# EAGLE design picostepsynth (EAGLE 9.6.2)
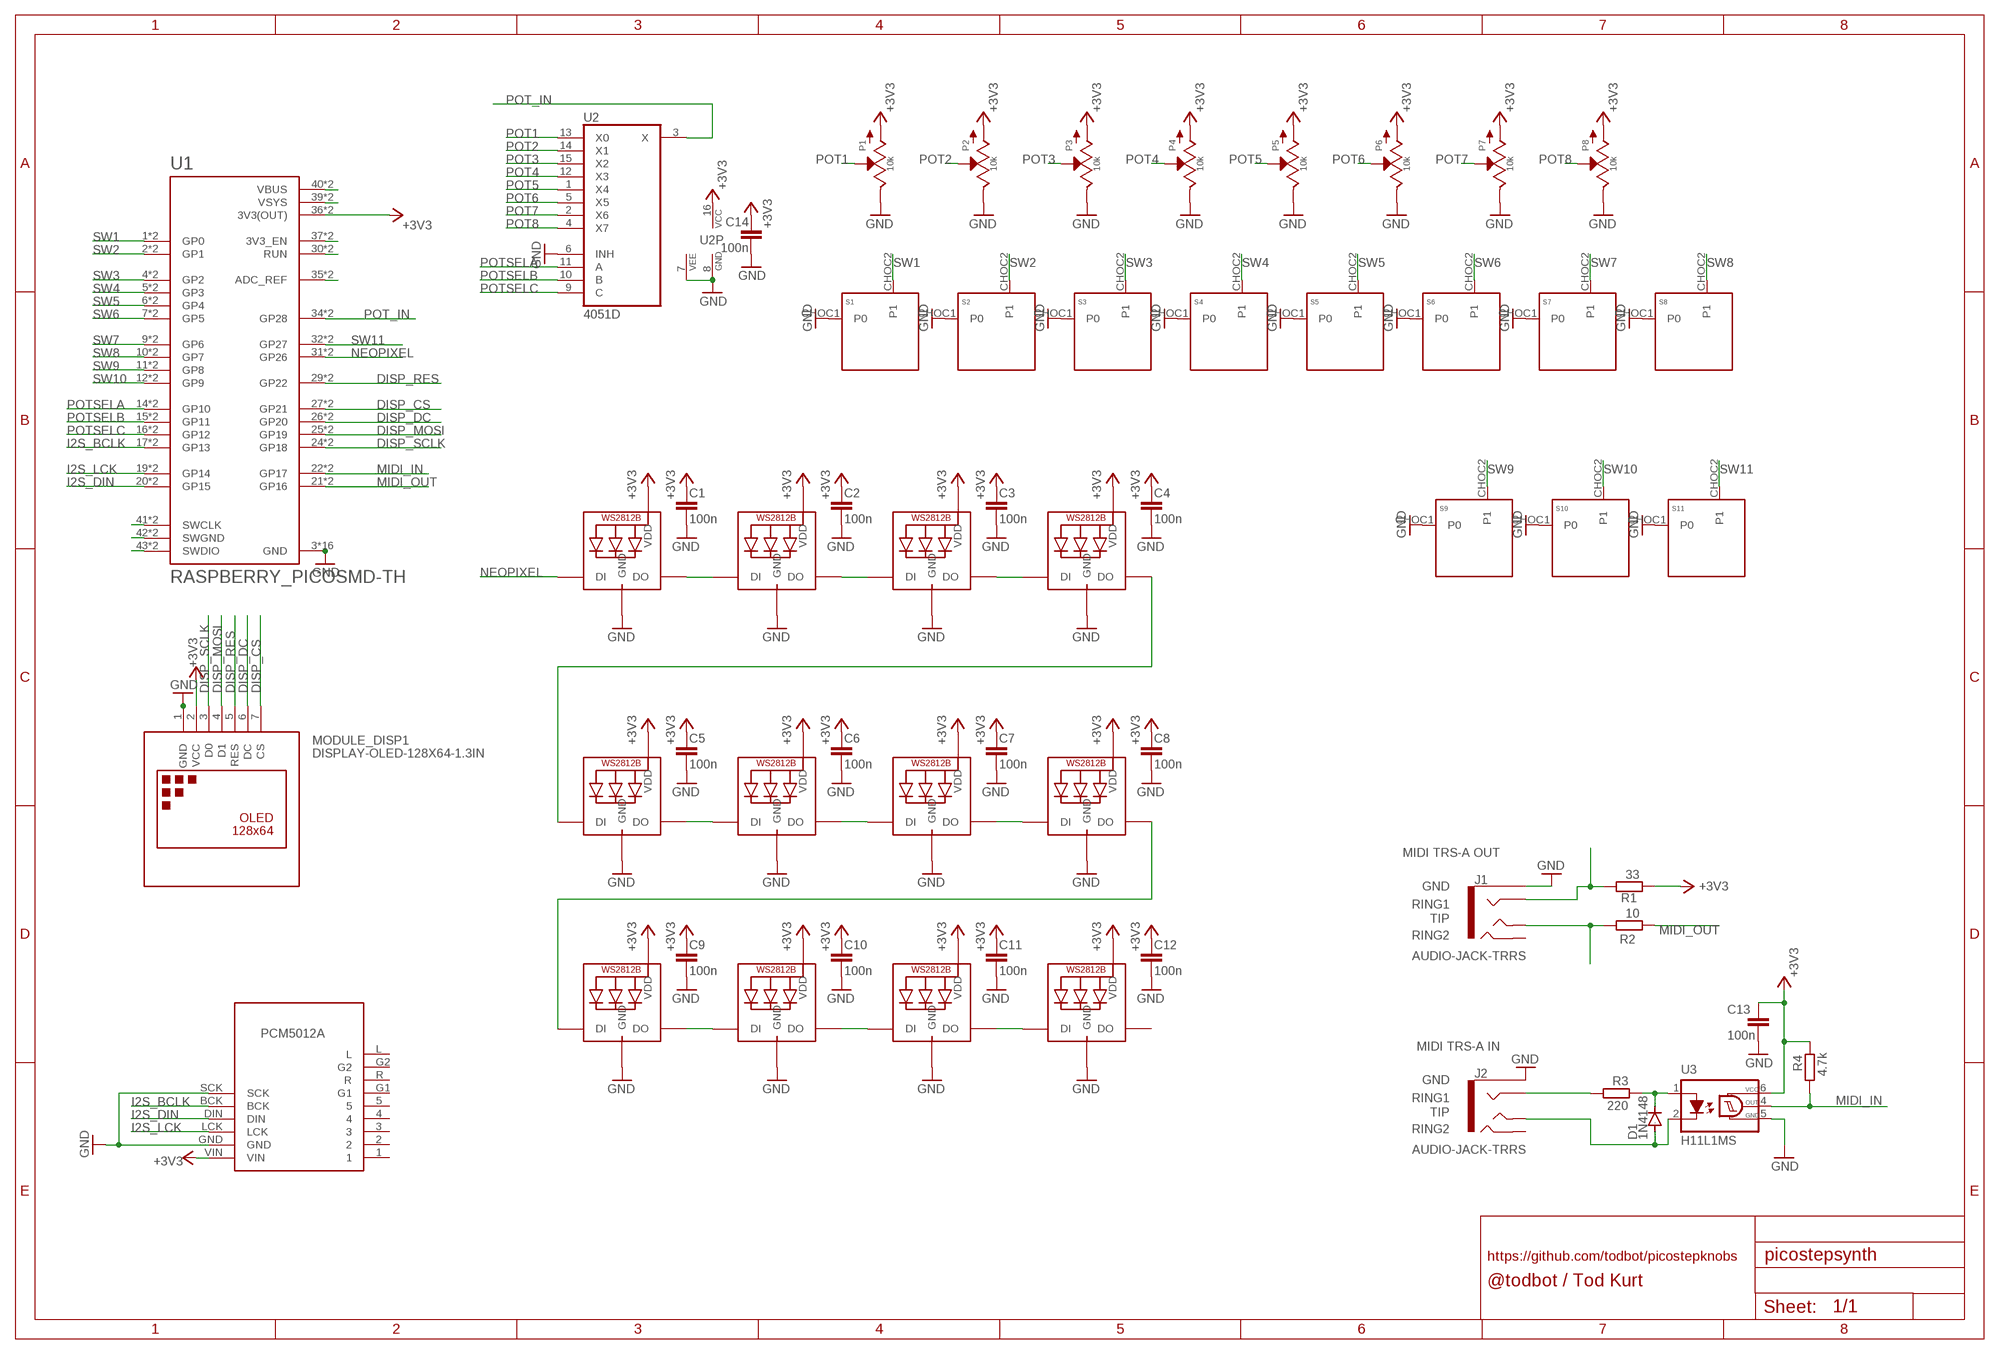
[diagram p0: schematic, sheet 1]

## Parts
C1  100n  C-EUC0805  [C0805]
C2  100n  C-EUC0805  [C0805]
C3  100n  C-EUC0805  [C0805]
C4  100n  C-EUC0805  [C0805]
C5  100n  C-EUC0805  [C0805]
C6  100n  C-EUC0805  [C0805]
C7  100n  C-EUC0805  [C0805]
C8  100n  C-EUC0805  [C0805]
C9  100n  C-EUC0805  [C0805]
C10  100n  C-EUC0805  [C0805]
C11  100n  C-EUC0805  [C0805]
C12  100n  C-EUC0805  [C0805]
C13  100n  C-EUC0805  [C0805]
C14  100n  C-EUC0805  [C0805]
D1  1N4148  DIODE-SOD123  [SOD123]
J1  AUDIO-JACK-TRRS  [PJ-320D_SPARKFUN]
J2  AUDIO-JACK-TRRS  [PJ-320D_SPARKFUN]
LED1  WS2812B5050  [WS2812B]
LED2  WS2812B5050  [WS2812B]
LED3  WS2812B5050  [WS2812B]
LED4  WS2812B5050  [WS2812B]
LED5  WS2812B5050  [WS2812B]
LED6  WS2812B5050  [WS2812B]
LED7  WS2812B5050  [WS2812B]
LED8  WS2812B5050  [WS2812B]
LED9  WS2812B5050  [WS2812B]
LED10  WS2812B5050  [WS2812B]
LED11  WS2812B5050  [WS2812B]
LED12  WS2812B5050  [WS2812B]
MODULE_DISP1  DISPLAY-OLED-128X64-1.3IN  [DISPLAY-OLED-128X64-1.3IN]
MODULE_PCM5102A  I2S_PCM_51XX_SOUNDCARD  [I2S_PCM_5100_SOUNDCARD]
P1  10k  POTZEPHPOT_BIGKNOB  [OG-POTS_ALPS_POT_VERTICAL_WITHBIGKNOB]
P2  10k  POTZEPHPOT_BIGKNOB  [OG-POTS_ALPS_POT_VERTICAL_WITHBIGKNOB]
P3  10k  POTZEPHPOT_BIGKNOB  [OG-POTS_ALPS_POT_VERTICAL_WITHBIGKNOB]
P4  10k  POTZEPHPOT_BIGKNOB  [OG-POTS_ALPS_POT_VERTICAL_WITHBIGKNOB]
P5  10k  POTZEPHPOT_BIGKNOB  [OG-POTS_ALPS_POT_VERTICAL_WITHBIGKNOB]
P6  10k  POTZEPHPOT_BIGKNOB  [OG-POTS_ALPS_POT_VERTICAL_WITHBIGKNOB]
P7  10k  POTZEPHPOT_BIGKNOB  [OG-POTS_ALPS_POT_VERTICAL_WITHBIGKNOB]
P8  10k  POTZEPHPOT_BIGKNOB  [OG-POTS_ALPS_POT_VERTICAL_WITHBIGKNOB]
R1  33  R-EU_R0805  [R0805]
R2  10  R-EU_R0805  [R0805]
R3  220  R-EU_R0805  [R0805]
R4  4.7k  R-EU_R0805  [R0805]
S1  KEYSWITCH-PLAIN-CHOC-1U  [CHOC-1U]
S2  KEYSWITCH-PLAIN-CHOC-1U  [CHOC-1U]
S3  KEYSWITCH-PLAIN-CHOC-1U  [CHOC-1U]
S4  KEYSWITCH-PLAIN-CHOC-1U  [CHOC-1U]
S5  KEYSWITCH-PLAIN-CHOC-1U  [CHOC-1U]
S6  KEYSWITCH-PLAIN-CHOC-1U  [CHOC-1U]
S7  KEYSWITCH-PLAIN-CHOC-1U  [CHOC-1U]
S8  KEYSWITCH-PLAIN-CHOC-1U  [CHOC-1U]
S9  KEYSWITCH-PLAIN-CHOC-1U  [CHOC-1U]
S10  KEYSWITCH-PLAIN-CHOC-1U  [CHOC-1U]
S11  KEYSWITCH-PLAIN-CHOC-1U  [CHOC-1U]
U1  RASPBERRY_PICOSMD-TH  [PICO-PKG]
U2  4051D  [SO16]
U3  H11L1MS  [DIL6-SMD]

## Nets
+3V3: C1.1 C2.1 C3.1 C4.1 C5.1 C6.1 C7.1 C8.1 C9.1 C10.1 C11.1 C12.1 C13.1 C14.1 LED1.1-VDD(VDD) LED2.1-VDD(VDD) LED3.1-VDD(VDD) LED4.1-VDD(VDD) LED5.1-VDD(VDD) LED6.1-VDD(VDD) LED7.1-VDD(VDD) LED8.1-VDD(VDD) LED9.1-VDD(VDD) LED10.1-VDD(VDD) LED11.1-VDD(VDD) LED12.1-VDD(VDD) MODULE_DISP1.2(VCC) MODULE_PCM5102A.VIN P1.P$3(A) P2.P$3(A) P3.P$3(A) P4.P$3(A) P5.P$3(A) P6.P$3(A) P7.P$3(A) P8.P$3(A) R1.2 R4.1 U1.36(3V3(OUT)) U1.P$36(3V3(OUT)) U2.16(VCC) U3.6(VCC)
DISP_CS: MODULE_DISP1.7(CS) U1.27(GP21) U1.P$27(GP21)
DISP_DC: MODULE_DISP1.6(DC) U1.26(GP20) U1.P$26(GP20)
DISP_MOSI: MODULE_DISP1.4(D1) U1.25(GP19) U1.P$25(GP19)
DISP_RES: MODULE_DISP1.5(RES) U1.29(GP22) U1.P$29(GP22)
DISP_SCLK: MODULE_DISP1.3(D0) U1.24(GP18) U1.P$24(GP18)
GND: C1.2 C2.2 C3.2 C4.2 C5.2 C6.2 C7.2 C8.2 C9.2 C10.2 C11.2 C12.2 C13.2 C14.2 J1.EARTH J2.EARTH LED1.3-GND(GND) LED2.3-GND(GND) LED3.3-GND(GND) LED4.3-GND(GND) LED5.3-GND(GND) LED6.3-GND(GND) LED7.3-GND(GND) LED8.3-GND(GND) LED9.3-GND(GND) LED10.3-GND(GND) LED11.3-GND(GND) LED12.3-GND(GND) MODULE_DISP1.1(GND) MODULE_PCM5102A.GND MODULE_PCM5102A.SCK P1.P$1(E) P2.P$1(E) P3.P$1(E) P4.P$1(E) P5.P$1(E) P6.P$1(E) P7.P$1(E) P8.P$1(E) S1.CHOC1(P0) S2.CHOC1(P0) S3.CHOC1(P0) S4.CHOC1(P0) S5.CHOC1(P0) S6.CHOC1(P0) S7.CHOC1(P0) S8.CHOC1(P0) S9.CHOC1(P0) S10.CHOC1(P0) S11.CHOC1(P0) U1.3(GND) U1.8(GND) U1.13(GND) U1.18(GND) U1.23(GND) U1.28(GND) U1.33(GND) U1.38(GND) U1.P$3(GND) U1.P$8(GND) U1.P$13(GND) U1.P$18(GND) U1.P$23(GND) U1.P$28(GND) U1.P$33(GND) U1.P$38(GND) U2.6(INH) U2.7(VEE) U2.8(GND) U3.5(GND)
I2S_BCLK: MODULE_PCM5102A.BCK U1.17(GP13) U1.P$17(GP13)
I2S_DIN: MODULE_PCM5102A.DIN U1.20(GP15) U1.P$20(GP15)
I2S_LCK: MODULE_PCM5102A.LCK U1.19(GP14) U1.P$19(GP14)
MIDI_IN: R4.2 U1.22(GP17) U1.P$22(GP17) U3.4(OUT)
MIDI_OUT: R2.2 U1.21(GP16) U1.P$21(GP16)
N$1: LED1.2-DOUT(DO) LED2.4-DIN(DI)
N$2: LED2.2-DOUT(DO) LED3.4-DIN(DI)
N$3: U1.37(3V3_EN) U1.P$37(3V3_EN)
N$4: LED3.2-DOUT(DO) LED4.4-DIN(DI)
N$5: U1.30(RUN) U1.P$30(RUN)
N$6: U1.35(ADC_REF) U1.P$35(ADC_REF)
N$7: U1.40(VBUS) U1.P$40(VBUS)
N$8: U1.39(VSYS) U1.P$39(VSYS)
N$9: J1.TIP R2.1
N$10: LED4.2-DOUT(DO) LED5.4-DIN(DI)
N$11: LED5.2-DOUT(DO) LED6.4-DIN(DI)
N$12: LED6.2-DOUT(DO) LED7.4-DIN(DI)
N$13: LED7.2-DOUT(DO) LED8.4-DIN(DI)
N$14: LED9.2-DOUT(DO) LED10.4-DIN(DI)
N$15: LED10.2-DOUT(DO) LED11.4-DIN(DI)
N$16: LED11.2-DOUT(DO) LED12.4-DIN(DI)
N$17: LED8.2-DOUT(DO) LED9.4-DIN(DI)
N$18: U1.41(SWCLK) U1.P$41(SWCLK)
N$19: U1.42(SWGND) U1.P$42(SWGND)
N$20: U1.43(SWDIO) U1.P$43(SWDIO)
N$38: J1.RING1 R1.1
N$47: D1.C R3.1 U3.1(A)
N$48: D1.A J2.TIP U3.2(C)
N$49: J2.RING1 R3.2
NEOPIXEL: LED1.4-DIN(DI) U1.31(GP26) U1.P$31(GP26)
POT1: P1.P$2(S) U2.13(X0)
POT2: P2.P$2(S) U2.14(X1)
POT3: P3.P$2(S) U2.15(X2)
POT4: P4.P$2(S) U2.12(X3)
POT5: P5.P$2(S) U2.1(X4)
POT6: P6.P$2(S) U2.5(X5)
POT7: P7.P$2(S) U2.2(X6)
POT8: P8.P$2(S) U2.4(X7)
POT_IN: U1.34(GP28) U1.P$34(GP28) U2.3(X)
POTSELA: U1.14(GP10) U1.P$14(GP10) U2.11(A)
POTSELB: U1.15(GP11) U1.P$15(GP11) U2.10(B)
POTSELC: U1.16(GP12) U1.P$16(GP12) U2.9(C)
SW1: S1.CHOC2(P1) U1.1(GP0) U1.P$1(GP0)
SW2: S2.CHOC2(P1) U1.2(GP1) U1.P$2(GP1)
SW3: S3.CHOC2(P1) U1.4(GP2) U1.P$4(GP2)
SW4: S4.CHOC2(P1) U1.5(GP3) U1.P$5(GP3)
SW5: S5.CHOC2(P1) U1.6(GP4) U1.P$6(GP4)
SW6: S6.CHOC2(P1) U1.7(GP5) U1.P$7(GP5)
SW7: S7.CHOC2(P1) U1.9(GP6) U1.P$9(GP6)
SW8: S8.CHOC2(P1) U1.10(GP7) U1.P$10(GP7)
SW9: S9.CHOC2(P1) U1.11(GP8) U1.P$11(GP8)
SW10: S10.CHOC2(P1) U1.12(GP9) U1.P$12(GP9)
SW11: S11.CHOC2(P1) U1.32(GP27) U1.P$32(GP27)
Unconnected: J1.RING2 J2.RING2 LED12.2-DOUT(DO) MODULE_PCM5102A.1 MODULE_PCM5102A.2 MODULE_PCM5102A.3 MODULE_PCM5102A.4 MODULE_PCM5102A.5 MODULE_PCM5102A.G1 MODULE_PCM5102A.G2 MODULE_PCM5102A.L MODULE_PCM5102A.R

## Notes on the sheet
- MIDI TRS-A OUT
- GND
- RING1
- TIP
- RING2
- PCM5012A
- MIDI TRS-A IN
- GND
- RING1
- TIP
- RING2
- https://github.com/todbot/picostepknobs
- @todbot / Tod Kurt

## Library data of the parts
C1-C14 = rcl:C-EU: CAPACITOR, European symbol; SPICEPREFIX: C
D1 = diode:DIODE-: DIODE
J1 J2 = audio_jacks_todbot:AUDIO-JACK-TRRS; LCSC: C431535; MPN: PJ-320D
LED1-LED12 = todstuff2023:WS2812B
MODULE_DISP1 = todstuff2023:DISPLAY-OLED-128X64: 128x64 Dot Matrix OLED Module based on SSD1306 chip or SH1106 Variant with SPI interface More details available here: http://www.instructables.com/id/How-to-use-OLED-display-arduino-module/ SSD1306 datasheet: https://cdn-shop.adafruit.com/datasheets/SSD1306.pdf SH1106 datasheet: https://cdn-shop.adafruit.com/product-files/5228/5223-ds.pdf Click here to find device on ebay.com <http://www.ebay.com/sch/oled+display+128x64> Note: There are two variants: I2C and SPI. Search for the proper version.
MODULE_PCM5102A = PCM5102A:I2S_PCM_51XX_SOUNDCARD
P1-P8 = EurorackModularParts:POT
R1-R4 = rcl:R-EU_: RESISTOR, European symbol; SPICEPREFIX: R
S1-S11 = Keyboard:KEYSWITCH-PLAIN
U1 = RpiPico:RASPBERRY_PICO: Raspberry Pi Pico
U2 = 40xx:4051: 8-channel ANALOG MULTIPLEXER
U3 = optocoupler:H11L*M: 6-Pin DIP Optocoupler Source: http://www.fairchildsemi.com/ds/H1/H11L2-M.pdf; LCSC: C78589; MPN2: H11L1S; OC_FARNELL: unknown; OC_NEWARK: unknown

## Board
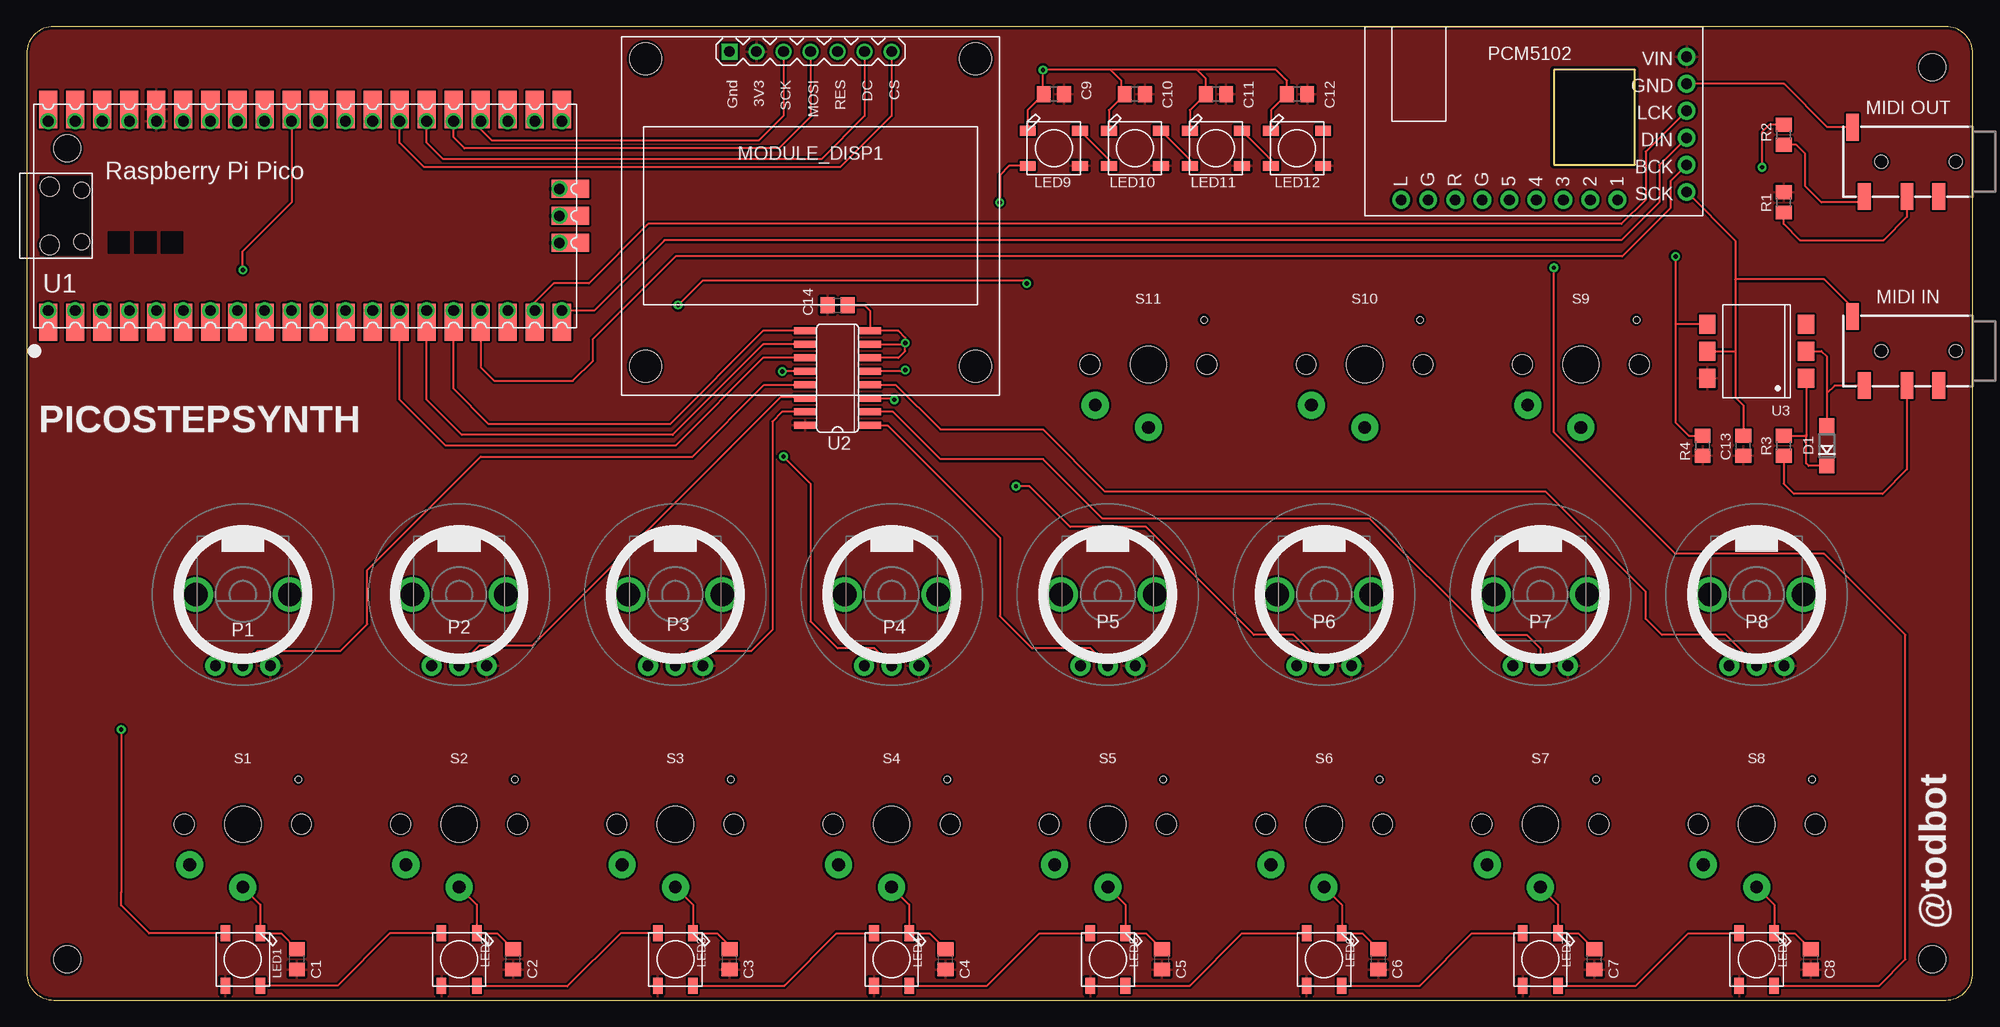
[diagram p1: board, top side]
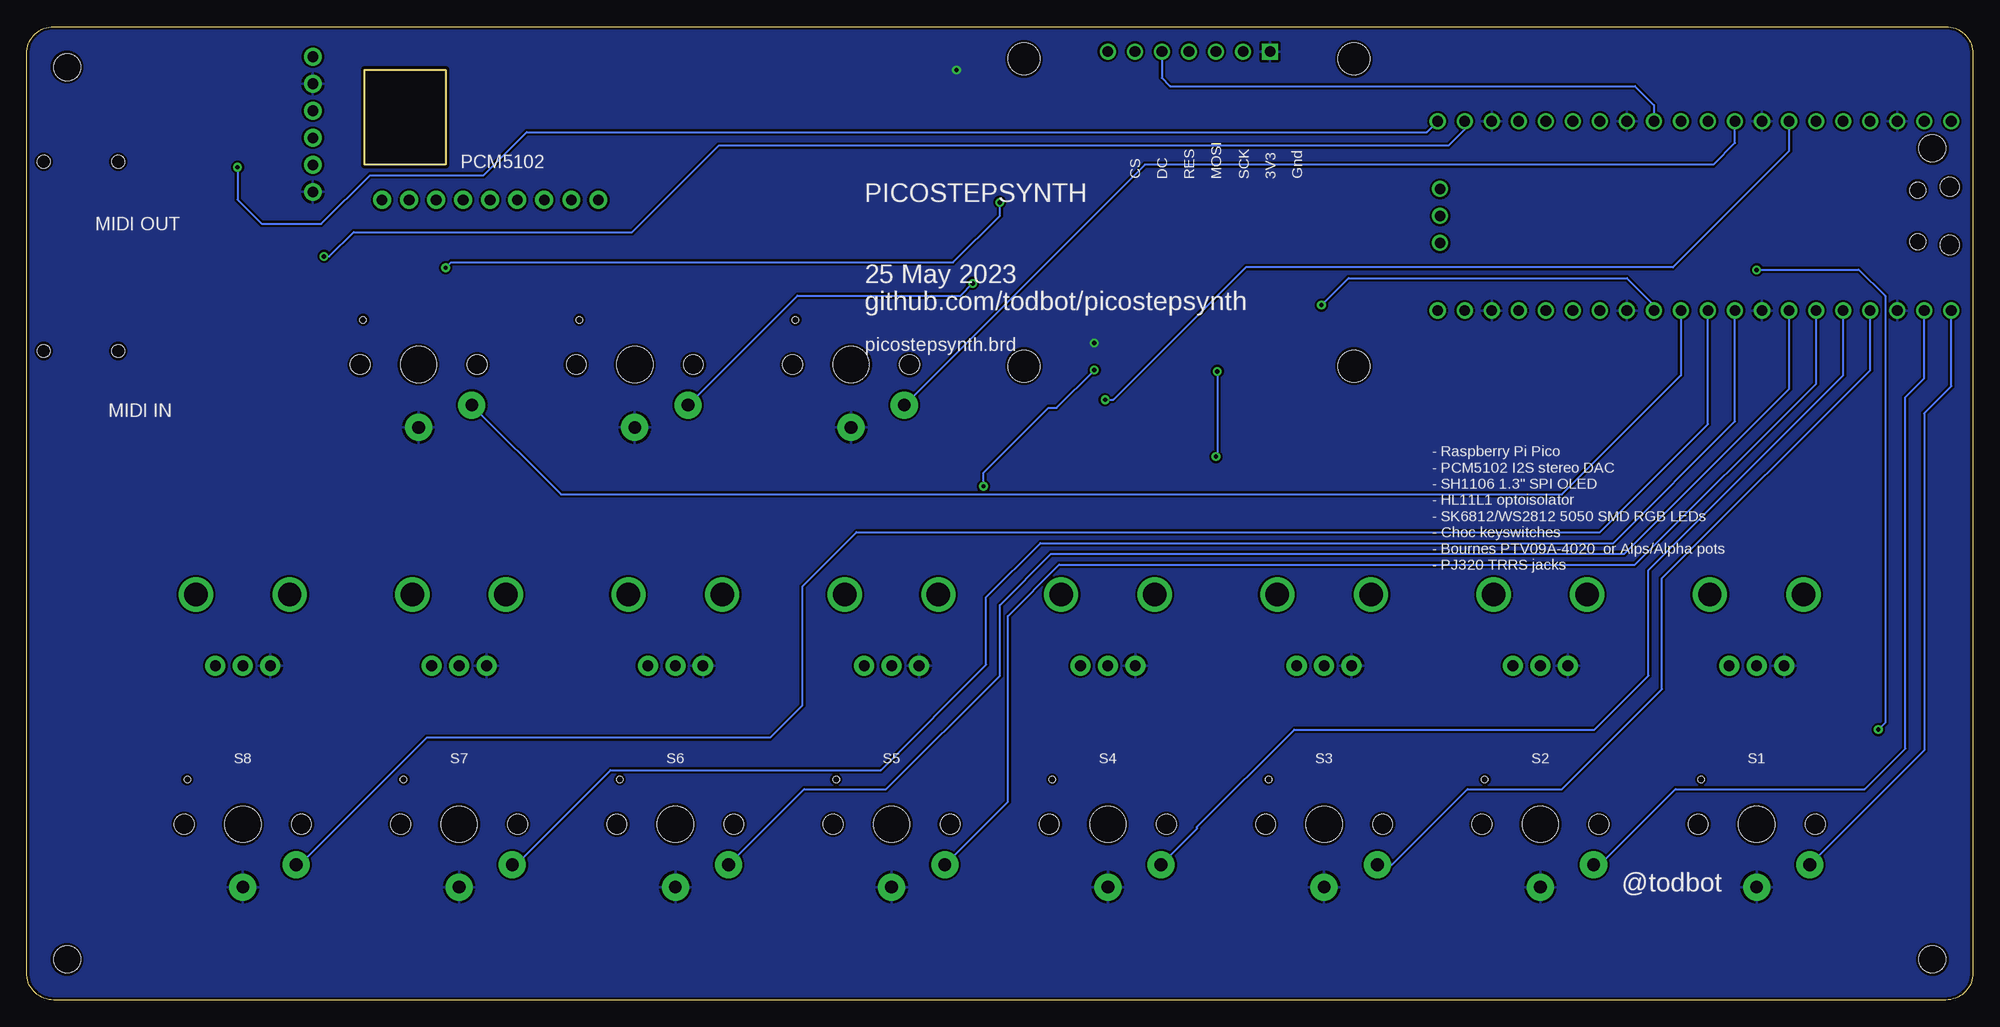
[diagram p2: board, bottom side, seen from below]

Size 182.88 x 91.44 mm. Coordinates in mm from the lower left corner, seen from the top.
Outline: 0,88.9 0,2.54 arc90 2.54,0 180.34,0 arc90 182.88,2.54 182.88,88.9 arc90 180.34,91.44 2.54,91.44 arc90 0,88.9
Outline: 151.13,87.38 143.51,87.38 143.51,78.49 151.13,78.49 151.13,87.38
Copper layers (1*16): Top 0.035mm / dielectric 1.5mm / Bottom 0.035mm
Design rules "adafruit-rules-20180530": minimum track width 8mil, minimum drill 16mil, track to track 8mil, track to pad 8mil, pad to pad 8mil, via to via 8mil, smd to smd 8mil, copper to edge 10mil, drill to drill 8mil, minimum pad ring 10mil, minimum via ring 8mil, stop-mask expansion 4mil, vias tented up to drill 20mil, thermal gap 10mil
Holes 2.54 mm at 3.81,3.81 179.07,3.81 179.07,87.63 3.81,80.01

### Footprints (pad centres in the part's own frame; a part is rotated, then mirrored left to right if it is on the bottom)
C0805 = smd 1.3 x 1.5: 1 -0.95,0; 2 0.95,0
SOD123 = smd 1.4 x 1.4: A 1.9,0; C -1.9,0
PJ-320D_SPARKFUN = smd 1.2 x 2.5: EARTH 11.3,-3.25; RING1 6.2,3.25; RING2 3.2,3.25; TIP 10.2,3.25 | hole 1.2: 1.6,0; 8.6,0
WS2812B = smd 1.5 x 0.9: 1-VDD 2.45,-1.65; 2-DOUT 2.45,1.65; 3-GND -2.45,1.65; 4-DIN -2.45,-1.65
DISPLAY-OLED-128X64-1.3IN = drill 1 square: 1 -7.62,15.43 | drill 1: 2 -5.08,15.43; 3 -2.54,15.43; 4 0,15.43; 5 2.54,15.43; 6 5.08,15.43; 7 7.62,15.43 | hole 3: -15.5,14.75; 15.5,14.75; 15.5,-14.115; -15.5,-14.115
I2S_PCM_5100_SOUNDCARD = drill 1 pad 1.676: 1 1.5,8; 2 1.5,10.54; 3 1.5,13.08; 4 1.5,15.62; 5 1.5,18.16; BCK 4.79,1.5; DIN 7.33,1.5; G1 1.5,20.7; G2 1.5,25.78; GND 12.41,1.5; L 1.5,28.32; LCK 9.87,1.5; R 1.5,23.24; SCK 2.25,1.5; VIN 14.95,1.5
OG-POTS_ALPS_POT_VERTICAL_WITHBIGKNOB = drill 1 pad 1.88: P$1 -2.58,-6.7; P$2 0,-6.7; P$3 2.58,-6.7 | drill 2.2 pad 3.175: P$4 4.4,0; P$5 -4.4,0
R0805 = smd 1.3 x 1.5: 1 -0.95,0; 2 0.95,0
CHOC-1U = drill 1.2 pad 2.54: CHOC1 0,5.9; CHOC2 5,3.8 | hole 3.4: 0,0 | hole 0.6: -5.22,-4.2 | hole 1.85: -5.5,0; 5.5,0
PICO-PKG = drill 1: 1 -8.89,24.13; 2 -8.89,21.59; 3 -8.89,19.05; 4 -8.89,16.51; 5 -8.89,13.97; 6 -8.89,11.43; 7 -8.89,8.89; 8 -8.89,6.35; 9 -8.89,3.81; 10 -8.89,1.27; 11 -8.89,-1.27; 12 -8.89,-3.81; 13 -8.89,-6.35; 14 -8.89,-8.89; 15 -8.89,-11.43; 16 -8.89,-13.97; 17 -8.89,-16.51; 18 -8.89,-19.05; 19 -8.89,-21.59; 20 -8.89,-24.13; 21 8.89,-24.13; 22 8.89,-21.59; 23 8.89,-19.05; 24 8.89,-16.51; 25 8.89,-13.97; 26 8.89,-11.43; 27 8.89,-8.89; 28 8.89,-6.35; 29 8.89,-3.81; 30 8.89,-1.27; 31 8.89,1.27; 32 8.89,3.81; 33 8.89,6.35; 34 8.89,8.89; 35 8.89,11.43; 36 8.89,13.97; 37 8.89,16.51; 38 8.89,19.05; 39 8.89,21.59; 40 8.89,24.13; 41 -2.54,-23.9; 42 0,-23.9; 43 2.54,-23.9 | smd 3.5 x 1.7: P$1 -10,24.13; P$2 -10,21.59; P$3 -10,19.05; P$4 -10,16.51; P$5 -10,13.97; P$6 -10,11.43; P$7 -10,8.89; P$8 -10,6.35; P$9 -10,3.81; P$10 -10,1.27; P$11 -10,-1.27; P$12 -10,-3.81; P$13 -10,-6.35; P$14 -10,-8.89; P$15 -10,-11.43; P$16 -10,-13.97; P$17 -10,-16.51; P$18 -10,-19.05; P$19 -10,-21.59; P$20 -10,-24.13; P$21 10,-24.13; P$22 10,-21.59; P$23 10,-19.05; P$24 10,-16.51; P$25 10,-13.97; P$26 10,-11.43; P$27 10,-8.89; P$28 10,-6.35; P$29 10,-3.81; P$30 10,-1.27; P$31 10,1.27; P$32 10,3.81; P$33 10,6.35; P$34 10,8.89; P$35 10,11.43; P$36 10,13.97; P$37 10,16.51; P$38 10,19.05; P$39 10,21.59; P$40 10,24.13 | smd 1.7 x 3.5: P$41 -2.54,-24.925; P$42 0,-24.925; P$43 2.54,-24.925 | hole 1.8: -2.725,24; 2.725,24 | hole 1.5: -2.425,20.97; 2.425,20.97
SO16 = smd 0.66 x 2.032: 1 -4.445,-3.073; 2 -3.175,-3.073; 3 -1.905,-3.073; 4 -0.635,-3.073; 5 0.635,-3.073; 6 1.905,-3.073; 7 3.175,-3.073; 8 4.445,-3.073; 9 4.445,3.073; 10 3.175,3.073; 11 1.905,3.073; 12 0.635,3.073; 13 -0.635,3.073; 14 -1.905,3.073; 15 -3.175,3.073; 16 -4.445,3.073
DIL6-SMD = smd 1.78 x 1.52: 1 -2.54,-4.645; 2 0,-4.645; 3 2.54,-4.645; 4 2.54,4.645; 5 0,4.645; 6 -2.54,4.645

### Placement (x,y rotation side)
C1  25.4,3.81 90 top
C2  45.72,3.81 90 top
C3  66.04,3.81 90 top
C4  86.36,3.81 90 top
C5  106.68,3.81 90 top
C6  127,3.81 90 top
C7  147.32,3.81 90 top
C8  167.64,3.81 90 top
C9  96.52,85.09 180 top
C10  104.14,85.09 180 top
C11  111.76,85.09 180 top
C12  119.38,85.09 180 top
C13  161.29,52.07 90 top
C14  76.2,65.28 0 top
D1  169.16,52.07 90 top
J1  182.88,78.74 180 top
J2  182.88,60.96 180 top
LED1  20.32,3.81 270 top
LED2  40.64,3.81 270 top
LED3  60.96,3.81 270 top
LED4  81.28,3.81 270 top
LED5  101.6,3.81 270 top
LED6  121.92,3.81 270 top
LED7  142.24,3.81 270 top
LED8  162.56,3.81 270 top
LED9  96.52,80.01 0 top
LED10  104.14,80.01 0 top
LED11  111.76,80.01 0 top
LED12  119.38,80.01 0 top
MODULE_DISP1  73.66,73.66 0 top
MODULE_PCM5102A  157.48,73.66 90 top
P1  20.32,38.1 0 top
P2  40.64,38.1 0 top
P3  60.96,38.1 0 top
P4  81.28,38.1 0 top
P5  101.6,38.1 0 top
P6  121.92,38.1 0 top
P7  142.24,38.1 0 top
P8  162.56,38.1 0 top
R1  165.1,74.93 90 top
R2  165.1,81.28 90 top
R3  165.1,52.07 270 top
R4  157.48,52.07 90 top
S1  20.32,16.51 180 top
S2  40.64,16.51 180 top
S3  60.96,16.51 180 top
S4  81.28,16.51 180 top
S5  101.6,16.51 180 top
S6  121.92,16.51 180 top
S7  142.24,16.51 180 top
S8  162.56,16.51 180 top
S9  146.05,59.69 180 top
S10  125.73,59.69 180 top
S11  105.41,59.69 180 top
U1  26.16,73.66 90 top
U2  76.2,58.42 90 top
U3  162.56,60.96 90 top

### Tracks (layer width: path | path; a pad name or v marks a point on that pad's centre or on a via)
+3V3
  Top 0.203: U1.P$36 U1.36
  pour Top: 183.14,91.52 183.14,0.25 -0.4,0.25 -0.4,91.52
DISP_CS
  Top 0.203: U1.P$27 U1.27 35.05,80.52 37.34,78.23 76.45,78.23 81.28,83.06 MODULE_DISP1.7
DISP_DC
  Top 0.203: U1.P$26 U1.26 37.59,80.52 39.12,78.99 74.68,78.99 78.74,83.06 MODULE_DISP1.6
DISP_MOSI
  Top 0.203: U1.P$25 U1.25 40.13,81.03 41.15,80.01 70.71,80.01 73.66,82.96 MODULE_DISP1.4
DISP_RES
  Top 0.203: U1.P$29 U1.29
  Bottom 0.203: MODULE_DISP1.5 76.2,86.61 75.44,85.85 31.75,85.85 29.97,84.07 U1.29
DISP_SCLK
  Top 0.203: U1.24 U1.P$24 42.67,81.79 43.69,80.77 68.83,80.77 71.12,83.06 MODULE_DISP1.3
GND  (via drill 0.41)
  Top 0.203: U1.P$23 U1.23 | U1.P$28 U1.28 | U1.P$38 U1.38 | U1.P$33 U1.33 | U1.P$3 U1.3 | U1.P$8 U1.8 | U1.P$18 U1.18 | U1.P$13 U1.13 | J1.EARTH 169.22,81.99 165.14,86.07 MODULE_PCM5102A.GND | v82.55,61.72 82.55,60.96 81.92,60.33 U2.6 | v82.55,61.72 82.55,62.23 81.92,62.87 U2.8 79.27,64.75 78.74,65.28 C14.2 | 160.55,67.69 160.55,71.34 MODULE_PCM5102A.SCK | J2.EARTH 171.58,65.02 168.91,67.69 160.55,67.69 | U2.7 82.42,61.59 v82.55,61.72 | 25.72,5.08 C1.2 23.9,6.26 LED1.3-GND 21.97,8.96 S1.CHOC1 | LED12.3-GND 116.93,83.59 C12.2 118.43,86.36 117.41,87.38 109.98,87.38 | LED11.3-GND 109.31,83.59 C11.2 110.81,86.55 109.98,87.38 | LED10.3-GND 101.69,83.59 C10.2 102.87,85.41 102.87,86.36 101.85,87.38 | LED9.3-GND 94.07,83.59 C9.2 95.5,85.16 v95.5,87.38 101.85,87.38 | 109.98,87.38 101.85,87.38 | S2.CHOC1 42.29,8.96 LED2.3-GND 44.22,6.26 C2.2 | S3.CHOC1 62.61,8.96 LED3.3-GND 64.86,6.26 66.04,5.08 C3.2 | S4.CHOC1 82.93,8.96 LED4.3-GND 84.86,6.26 C4.2 | S5.CHOC1 103.25,8.96 LED5.3-GND 105.18,6.26 C5.2 | S6.CHOC1 123.57,8.96 LED6.3-GND 125.5,6.26 C6.2 | S7.CHOC1 143.89,8.96 LED7.3-GND 145.82,6.26 C7.2 | S8.CHOC1 164.21,8.96 LED8.3-GND 166.14,6.26 C8.2 | C13.2 161.29,55.88 160.55,56.62 160.55,60.96 | 160.55,67.69 160.55,60.96 | U3.5 160.55,60.96
  pour Bottom: 0,92.52 185.42,92.52 185.42,0.25 0,0.25
I2S_BCLK
  Top 0.203: U1.17 U1.P$17 42.67,59.44 43.94,58.17 51.31,58.17 53.21,60.07 53.21,62.1 60.96,69.85 149.92,69.85 154.46,74.39 154.46,76.93 MODULE_PCM5102A.BCK
I2S_DIN
  Top 0.203: MODULE_PCM5102A.DIN 153.42,78.43 153.42,74.93 149.86,71.37 59.94,71.37 53.34,64.77 U1.20 U1.P$20
I2S_LCK
  Top 0.203: U1.P$19 U1.19 47.75,65.53 49.53,67.31 52.83,67.31 58.42,72.9 149.86,72.9 152.15,75.18 152.15,79.7 MODULE_PCM5102A.LCK
MIDI_IN  (via drill 0.41)
  Top 0.203: U1.P$22 U1.22 | v154.94,69.85 154.94,63.5 | 154.94,63.5 154.94,54.29 156.21,53.02 R4.2 | U3.4 154.94,63.5
  Bottom 0.203: v154.94,69.85 154.43,69.85 152.15,72.14 125.98,72.14 117.86,80.26 49.28,80.26 47.75,81.79 U1.22
MIDI_OUT  (via drill 0.41)
  Top 0.203: U1.P$21 U1.21 | R2.2 163.76,82.23 163.07,81.53 v163.07,78.23
  Bottom 0.203: U1.21 51.31,81.53 135.89,81.53 139.95,77.47 150.62,77.47 155.19,72.9 160.78,72.9 163.07,75.18 v163.07,78.23
N$1
  Top 0.203: LED1.2-DOUT 29.21,1.36 34.12,6.26 LED2.4-DIN
N$2
  Top 0.203: LED3.4-DIN 55.79,6.26 50.8,1.27 41.91,1.27 42,1.36 LED2.2-DOUT
N$3
  Top 0.203: U1.P$37 U1.37
N$4
  Top 0.203: LED3.2-DOUT 71.21,1.36 76.11,6.26 LED4.4-DIN
N$5
  Top 0.203: U1.P$30 U1.30
N$6
  Top 0.203: U1.P$35 U1.35
N$7
  Top 0.203: U1.P$40 U1.40
N$8
  Top 0.203: U1.P$39 U1.39
N$9
  Top 0.203: R2.1 166.3,80.33 167.13,79.5 167.13,76.45 168.66,74.93 172.12,74.93 J1.TIP
N$10
  Top 0.203: LED4.2-DOUT 90.26,1.36 95.16,6.26 LED5.4-DIN
N$11
  Top 0.203: LED5.2-DOUT 109.31,1.36 114.21,6.26 LED6.4-DIN
N$12
  Top 0.203: LED6.2-DOUT 130.9,1.36 135.8,6.26 LED7.4-DIN
N$13
  Top 0.203: LED7.2-DOUT 151.22,1.36 156.12,6.26 LED8.4-DIN
N$14
  Top 0.203: LED10.4-DIN 101.69,78.94 LED9.2-DOUT
N$15
  Top 0.203: LED10.2-DOUT 109.31,78.94 LED11.4-DIN
N$16
  Top 0.203: LED11.2-DOUT 116.93,78.94 LED12.4-DIN
N$17  (via drill 0.41)
  Top 0.203: v143.51,68.78 143.51,53.34 154.94,41.91 168.91,41.91 176.53,34.29 176.53,3.81 174.08,1.36 LED8.2-DOUT | v91.44,74.93 91.44,77.47 92.33,78.36 LED9.4-DIN
  Bottom 0.203: v143.51,68.78 143,69.29 95.81,69.29 91.44,73.66 v91.44,74.93
N$18
  Top 0.203: U1.P$41 U1.41
N$19
  Top 0.203: U1.P$42 U1.42
N$20
  Top 0.203: U1.P$43 U1.43
N$38
  Top 0.203: J1.RING1 176.68,73.56 174.5,71.37 166.62,71.37 165.1,72.9 R1.1
N$47
  Top 0.203: R3.1 167.09,53.02 167.21,52.91 | U3.1 167.21,52.91 | 167.21,52.91 167.21,50.41 167.45,50.17 D1.C
N$48
  Top 0.203: J2.TIP 169.89,57.71 169.16,56.99 D1.A 169.16,60.45 168.66,60.96 U3.2
N$49
  Top 0.203: J2.RING1 176.68,49.84 174.39,47.55 166.06,47.55 165.1,48.51 R3.2
NEOPIXEL  (via drill 0.41)
  Top 0.203: v8.89,25.4 8.89,10.16 8.89,10.07 8.89,8.89 11.52,6.26 LED1.4-DIN | U1.P$31 U1.31 24.89,74.93 20.32,70.36 v20.32,68.58
  Bottom 0.203: v8.89,25.4 8.26,26.04 8.26,66.14 10.74,68.62 20.32,68.62 v20.32,68.58
POT1
  Top 0.203: P1.P$2 21.69,32.77 29.46,32.77 32,35.31 32,40.39 42.67,51.05 62.59,51.05 69.32,57.78 U2.13
POT2
  Top 0.203: U2.14 73.03,56.62 70.84,56.62 47.5,33.27 42.51,33.27 P2.P$2
POT3
  Top 0.203: P3.P$2 62.33,32.77 68.07,32.77 70.08,34.77 70.08,54.33 70.99,55.24 U2.15
POT4  (via drill 0.41)
  Top 0.203: U2.12 v70.99,59.05 | P4.P$2 79.66,33.02 76.2,33.02 73.66,35.56 73.66,48.51 v71.12,51.05
  Bottom 0.203: v70.99,59.05 70.99,51.18 v71.12,51.05
POT5
  Top 0.203: U2.1 80.9,53.98 91.44,43.43 91.44,36.07 94.49,33.02 99.98,33.02 P5.P$2
POT6  (via drill 0.41)
  Top 0.203: P6.P$2 119.03,34.29 115.32,34.29 105.16,44.45 98.04,44.45 94.23,48.26 v92.96,48.26 | v82.55,59.18 82.42,59.05 U2.5
  Bottom 0.203: v92.96,48.26 92.96,49.53 86.87,55.63 86.11,55.63 v82.55,59.18
POT7
  Top 0.203: U2.2 81.41,55.24 85.85,50.8 95.5,50.8 101.09,45.21 126.24,45.21 137.16,34.29 140.97,34.29 142.24,33.02 P7.P$2
POT8
  Top 0.203: P8.P$2 159.67,34.29 153.67,34.29 152.15,35.81 152.15,38.35 142.75,47.75 101.35,47.75 95.5,53.59 85.85,53.59 81.66,57.78 U2.4
POT_IN  (via drill 0.41)
  Top 0.203: U1.P$34 U1.34 | U2.3 81.41,56.52 v81.53,56.39
  Bottom 0.203: U1.34 17.27,79.76 28.19,68.83 68.33,68.83 80.77,56.39 v81.53,56.39
POTSELA
  Top 0.203: U1.14 U1.P$14 35.05,56.39 39.37,52.07 60.96,52.07 69.22,60.33 U2.11
POTSELB
  Top 0.203: U1.15 U1.P$15 37.59,56.39 40.89,53.09 60.71,53.09 69.22,61.59 U2.10
POTSELC
  Top 0.203: U1.16 U1.P$16 40.13,57.4 43.43,54.1 60.45,54.1 69.22,62.87 U2.9
SW1
  Top 0.203: U1.P$1 U1.1
  Bottom 0.203: U1.1 2.03,57.66 4.57,55.12 4.57,23.46 S1.CHOC2
SW2
  Top 0.203: U1.P$2 U1.2
  Bottom 0.203: S2.CHOC2 35.04,12.71 27.94,19.81 10.16,19.81 6.35,23.62 6.35,56.64 4.57,58.42 U1.2
SW3
  Top 0.203: U1.P$4 U1.4
  Bottom 0.203: S3.CHOC2 54.6,12.71 47.5,19.81 38.61,19.81 29.21,29.21 29.21,39.62 9.65,59.18 U1.4
SW4
  Top 0.203: U1.P$5 U1.5
  Bottom 0.203: S4.CHOC2 72.9,16.09 72.9,16.26 63.75,25.4 35.56,25.4 30.48,30.48 30.48,40.39 12.19,58.67 U1.5
SW5
  Top 0.203: U1.P$6 U1.6
  Bottom 0.203: U1.6 14.73,57.91 31.75,40.89 85.85,40.89 90.68,36.07 90.68,18.63 S5.CHOC2
SW6
  Top 0.203: U1.P$7 U1.7
  Bottom 0.203: S6.CHOC2 109.82,19.81 102.11,19.81 91.44,30.48 91.44,37.08 86.61,41.91 32.77,41.91 17.27,57.4 U1.7
SW7
  Top 0.203: U1.P$9 U1.9
  Bottom 0.203: S7.CHOC2 136.9,12.71 128.02,21.59 102.62,21.59 92.71,31.5 92.71,37.85 87.63,42.93 33.78,42.93 22.35,54.36 U1.9
SW8
  Top 0.203: U1.P$10 U1.10
  Bottom 0.203: S8.CHOC2 157.22,12.71 145.29,24.64 113.03,24.64 109.98,27.69 109.98,38.86 104.9,43.94 35.05,43.94 24.89,54.1 U1.10
SW9
  Top 0.203: U1.P$11 U1.11
  Bottom 0.203: U1.11 27.43,58.67 38.61,47.5 132.66,47.5 S9.CHOC2
SW10  (via drill 0.41)
  Top 0.203: U1.P$12 U1.12 | v93.98,67.31 93.7,67.59 63.52,67.59 v61.21,65.28
  Bottom 0.203: v93.98,67.31 95.12,66.17 110.45,66.17 S10.CHOC2 | U1.12 29.97,65.28 32.51,67.82 58.67,67.82 v61.21,65.28
SW11
  Top 0.203: U1.P$32 U1.32
  Bottom 0.203: U1.32 22.35,80.52 24.38,78.49 77.81,78.49 S11.CHOC2

### Text on the board
tPlace: PCM5102 | Gnd | 3V3 | SCK | MOSI | RES | DC | CS | MIDI OUT | Raspberry Pi Pico | MIDI IN | PICOSTEPSYNTH | @todbot
bPlace: PCM5102 | Gnd | 3V3 | SCK | MOSI | RES | DC | CS | PICOSTEPSYNTH | MIDI OUT | 25 May 2023 | github.com/todbot/picostepsynth | picostepsynth.brd | MIDI IN | - Raspberry Pi Pico / - PCM5102 I2S stereo DAC / - SH1106 1.3" SPI OLED / - HL11L1 optoisolator / - SK6812/WS2812 5050 SMD RGB LEDs / - Choc keyswitches / - Bournes PTV09A-4020 or Alps/Alpha pots / - PJ320 TRRS jacks | @todbot